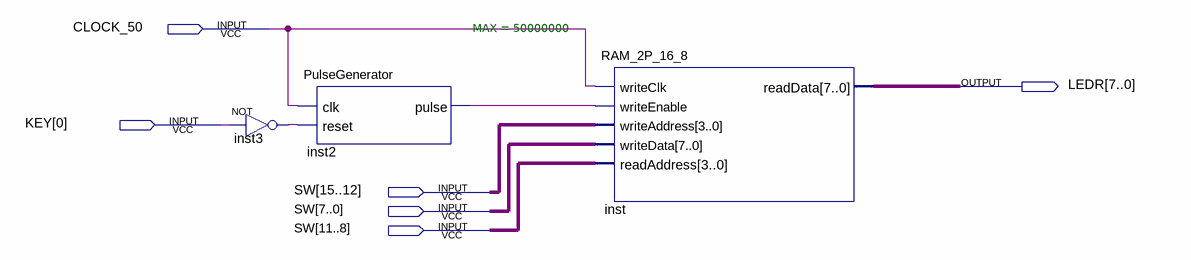
[diagram p0: schematic sheet]
// Quartus schematic RAM_2P_Demo.bdf as structural Verilog: 3 symbols, 6 pins
module RAM_2P_Demo (
  input  CLOCK_50,
  input  [0:0] KEY,
  input  [15:0] SW,
  output [7:0] LEDR
);

  wire inst2_pulse, inst3_out;

  PulseGenerator #(.MAX(50000000)) inst2 (.clk(CLOCK_50), .reset(inst3_out), .pulse(inst2_pulse));
  not inst3 (inst3_out, KEY[0]);
  RAM_2P_16_8 inst (
    .writeClk(CLOCK_50), .writeEnable(inst2_pulse), .writeAddress(SW[15:12]), .writeData(SW[7:0]),
    .readAddress(SW[11:8]), .readData(LEDR));
endmodule
